# EAGLE design ATX80 (EAGLE 9.2.0)
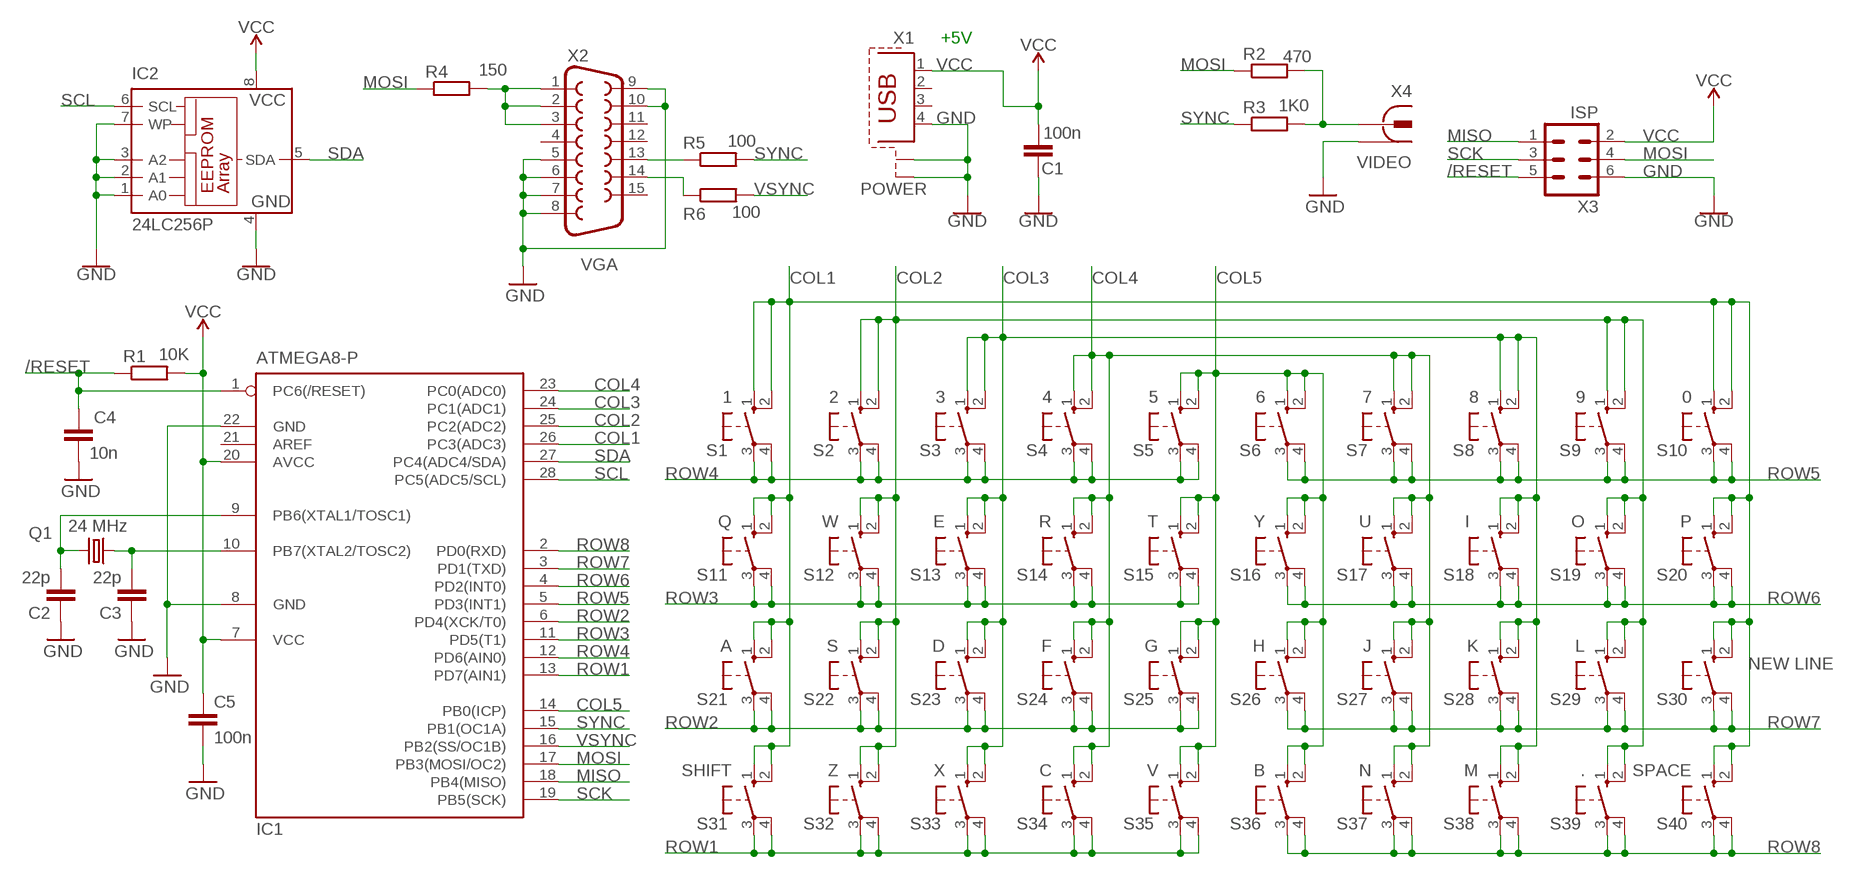
[diagram p0: schematic, sheet 1]

## Parts
C1  100n  C-EU050-024X044  [C050-024X044]
C2  22p  C-EU050-024X044  [C050-024X044]
C3  22p  C-EU050-024X044  [C050-024X044]
C4  10n  C-EU050-024X044  [C050-024X044]
C5  100n  C-EU050-024X044  [C050-024X044]
IC1  ATMEGA8-P  MEGA8-P  [DIL28-3]
IC2  24LC256P  [DIL8]
Q1  24 MHz  CRYSTALHC49U-V  [HC49U-V]
R1  10K  R-EU_0204/7  [0204/7]
R2  470  R-EU_0204/7  [0204/7]
R3  1K0  R-EU_0204/7  [0204/7]
R4  150  R-EU_0204/7  [0204/7]
R5  100  R-EU_0204/7  [0204/7]
R6  100  R-EU_0204/7  [0204/7]
S1  1  10-XX  [B3F-10XX]
S2  2  10-XX  [B3F-10XX]
S3  3  10-XX  [B3F-10XX]
S4  4  10-XX  [B3F-10XX]
S5  5  10-XX  [B3F-10XX]
S6  6  10-XX  [B3F-10XX]
S7  7  10-XX  [B3F-10XX]
S8  8  10-XX  [B3F-10XX]
S9  9  10-XX  [B3F-10XX]
S10  0  10-XX  [B3F-10XX]
S11  Q  10-XX  [B3F-10XX]
S12  W  10-XX  [B3F-10XX]
S13  E  10-XX  [B3F-10XX]
S14  R  10-XX  [B3F-10XX]
S15  T  10-XX  [B3F-10XX]
S16  Y  10-XX  [B3F-10XX]
S17  U  10-XX  [B3F-10XX]
S18  I  10-XX  [B3F-10XX]
S19  O  10-XX  [B3F-10XX]
S20  P  10-XX  [B3F-10XX]
S21  A  10-XX  [B3F-10XX]
S22  S  10-XX  [B3F-10XX]
S23  D  10-XX  [B3F-10XX]
S24  F  10-XX  [B3F-10XX]
S25  G  10-XX  [B3F-10XX]
S26  H  10-XX  [B3F-10XX]
S27  J  10-XX  [B3F-10XX]
S28  K  10-XX  [B3F-10XX]
S29  L  10-XX  [B3F-10XX]
S30  NEW LINE  10-XX  [B3F-10XX]
S31  SHIFT  10-XX  [B3F-10XX]
S32  Z  10-XX  [B3F-10XX]
S33  X  10-XX  [B3F-10XX]
S34  C  10-XX  [B3F-10XX]
S35  V  10-XX  [B3F-10XX]
S36  B  10-XX  [B3F-10XX]
S37  N  10-XX  [B3F-10XX]
S38  M  10-XX  [B3F-10XX]
S39  .  10-XX  [B3F-10XX]
S40  SPACE  10-XX  [B3F-10XX]
X1  POWER  PN61729-S  [PN61729-S]
X2  VGA  F15HDH  [HDF15H]
X3  ISP  ML6L  [ML6L]
X4  VIDEO  736880-49  [736880-49]

## Nets
/RESET: C4.1 IC1.1(PC6(/RESET)) R1.1 X3.5
COL1: IC1.26(PC3(ADC3)) S1.1(S) S1.2(S1) S10.1(S) S10.2(S1) S11.1(S) S11.2(S1) S20.1(S) S20.2(S1) S21.1(S) S21.2(S1) S30.1(S) S30.2(S1) S31.1(S) S31.2(S1) S40.1(S) S40.2(S1)
COL2: IC1.25(PC2(ADC2)) S2.1(S) S2.2(S1) S9.1(S) S9.2(S1) S12.1(S) S12.2(S1) S19.1(S) S19.2(S1) S22.1(S) S22.2(S1) S29.1(S) S29.2(S1) S32.1(S) S32.2(S1) S39.1(S) S39.2(S1)
COL3: IC1.24(PC1(ADC1)) S3.1(S) S3.2(S1) S8.1(S) S8.2(S1) S13.1(S) S13.2(S1) S18.1(S) S18.2(S1) S23.1(S) S23.2(S1) S28.1(S) S28.2(S1) S33.1(S) S33.2(S1) S38.1(S) S38.2(S1)
COL4: IC1.23(PC0(ADC0)) S4.1(S) S4.2(S1) S7.1(S) S7.2(S1) S14.1(S) S14.2(S1) S17.1(S) S17.2(S1) S24.1(S) S24.2(S1) S27.1(S) S27.2(S1) S34.1(S) S34.2(S1) S37.1(S) S37.2(S1)
COL5: IC1.14(PB0(ICP)) S5.1(S) S5.2(S1) S6.1(S) S6.2(S1) S15.1(S) S15.2(S1) S16.1(S) S16.2(S1) S25.1(S) S25.2(S1) S26.1(S) S26.2(S1) S35.1(S) S35.2(S1) S36.1(S) S36.2(S1)
GND: C1.1 C2.1 C3.1 C4.2 C5.2 IC1.8(GND) IC1.22(GND) IC2.1(A0) IC2.2(A1) IC2.3(A2) IC2.4(GND) IC2.7(WP) X1.4 X1.S1 X1.S2 X2.5 X2.6 X2.7 X2.8 X2.9 X2.10 X3.6 X4.1 X4.1@1 X4.1@2
MISO: IC1.18(PB4(MISO)) X3.1
MOSI: IC1.17(PB3(MOSI/OC2)) R2.1 R4.1 X3.4
N$2: R6.1 X2.14
N$13: R5.1 X2.13
N$14: R4.2 X2.1 X2.2 X2.3
N$15: C2.2 IC1.9(PB6(XTAL1/TOSC1)) Q1.2
N$16: C3.2 IC1.10(PB7(XTAL2/TOSC2)) Q1.1
N$18: R2.2 R3.2 X4.2
ROW1: IC1.13(PD7(AIN1)) S31.3(P) S31.4(P1) S32.3(P) S32.4(P1) S33.3(P) S33.4(P1) S34.3(P) S34.4(P1) S35.3(P) S35.4(P1)
ROW2: IC1.6(PD4(XCK/T0)) S21.3(P) S21.4(P1) S22.3(P) S22.4(P1) S23.3(P) S23.4(P1) S24.3(P) S24.4(P1) S25.3(P) S25.4(P1)
ROW3: IC1.11(PD5(T1)) S11.3(P) S11.4(P1) S12.3(P) S12.4(P1) S13.3(P) S13.4(P1) S14.3(P) S14.4(P1) S15.3(P) S15.4(P1)
ROW4: IC1.12(PD6(AIN0)) S1.3(P) S1.4(P1) S2.3(P) S2.4(P1) S3.3(P) S3.4(P1) S4.3(P) S4.4(P1) S5.3(P) S5.4(P1)
ROW5: IC1.5(PD3(INT1)) S6.3(P) S6.4(P1) S7.3(P) S7.4(P1) S8.3(P) S8.4(P1) S9.3(P) S9.4(P1) S10.3(P) S10.4(P1)
ROW6: IC1.4(PD2(INT0)) S16.3(P) S16.4(P1) S17.3(P) S17.4(P1) S18.3(P) S18.4(P1) S19.3(P) S19.4(P1) S20.3(P) S20.4(P1)
ROW7: IC1.3(PD1(TXD)) S26.3(P) S26.4(P1) S27.3(P) S27.4(P1) S28.3(P) S28.4(P1) S29.3(P) S29.4(P1) S30.3(P) S30.4(P1)
ROW8: IC1.2(PD0(RXD)) S36.3(P) S36.4(P1) S37.3(P) S37.4(P1) S38.3(P) S38.4(P1) S39.3(P) S39.4(P1) S40.3(P) S40.4(P1)
SCK: IC1.19(PB5(SCK)) X3.3
SCL: IC1.28(PC5(ADC5/SCL)) IC2.6(SCL)
SDA: IC1.27(PC4(ADC4/SDA)) IC2.5(SDA)
SYNC: IC1.15(PB1(OC1A)) R3.1 R5.2
VCC: C1.2 C5.1 IC1.7(VCC) IC1.20(AVCC) IC2.8(VCC) R1.2 X1.1 X3.2
VSYNC: IC1.16(PB2(SS/OC1B)) R6.2
Unconnected: IC1.21(AREF) X1.2 X1.3 X2.4 X2.11 X2.12 X2.15

## Notes on the sheet
- +5V

## Library data of the parts
C1-C5 = rcl:C-EU: CAPACITOR, European symbol; SPICEPREFIX: C
IC1 = atmel:MEGA8-P: MICROCONTROLLER 8 Kbytes FLASH, 1 kbytes SRAM, 512 bytes EEPROM, USART, 4-channel 10 bit ADC, 2-channel 8 bit ADC Pin compatible with Atmega48, ATMega88, ATMega168 Source: avr.lbr; OC_FARNELL: unknown; OC_NEWARK: unknown
IC2 = microchip:24*: Serial EEPROM I2C; MF: MICROCHIP; MPN: 24LC256-E/P; OC_FARNELL: 9757970; OC_NEWARK: 92C7169
Q1 = crystal:CRYSTAL: CRYSTAL; OC_FARNELL: 1666969; OC_NEWARK: unknown
R1-R6 = rcl:R-EU_: RESISTOR, European symbol; SPICEPREFIX: R
S1-S40 = switch-omron2:10-XX: OMRON SWITCH; MPN: B3F-1000; OC_FARNELL: 176432; OC_NEWARK: 36M3542
X1 = con-berg:PN61729-S: BERG USB connector; OC_FARNELL: unknown; OC_NEWARK: unknown
X2 = adafruit_B:F15: SUB-D HDH is also known as a 'right angle VGA' connector
X3 = con-ml:ML6L: HARTING; OC_FARNELL: unknown; OC_NEWARK: unknown
X4 = con-conrad:736880-49: Cinch Connector ( RCA Jack ) Cinch-Einbaukupplung 90º 72345 Vernickelt BKL Electronic Source: Conrad <http://www.conrad.de/ce/de/product/736880>

## Net classes
0 default: width 0.6 mm, drill 0.3 mm

## Board
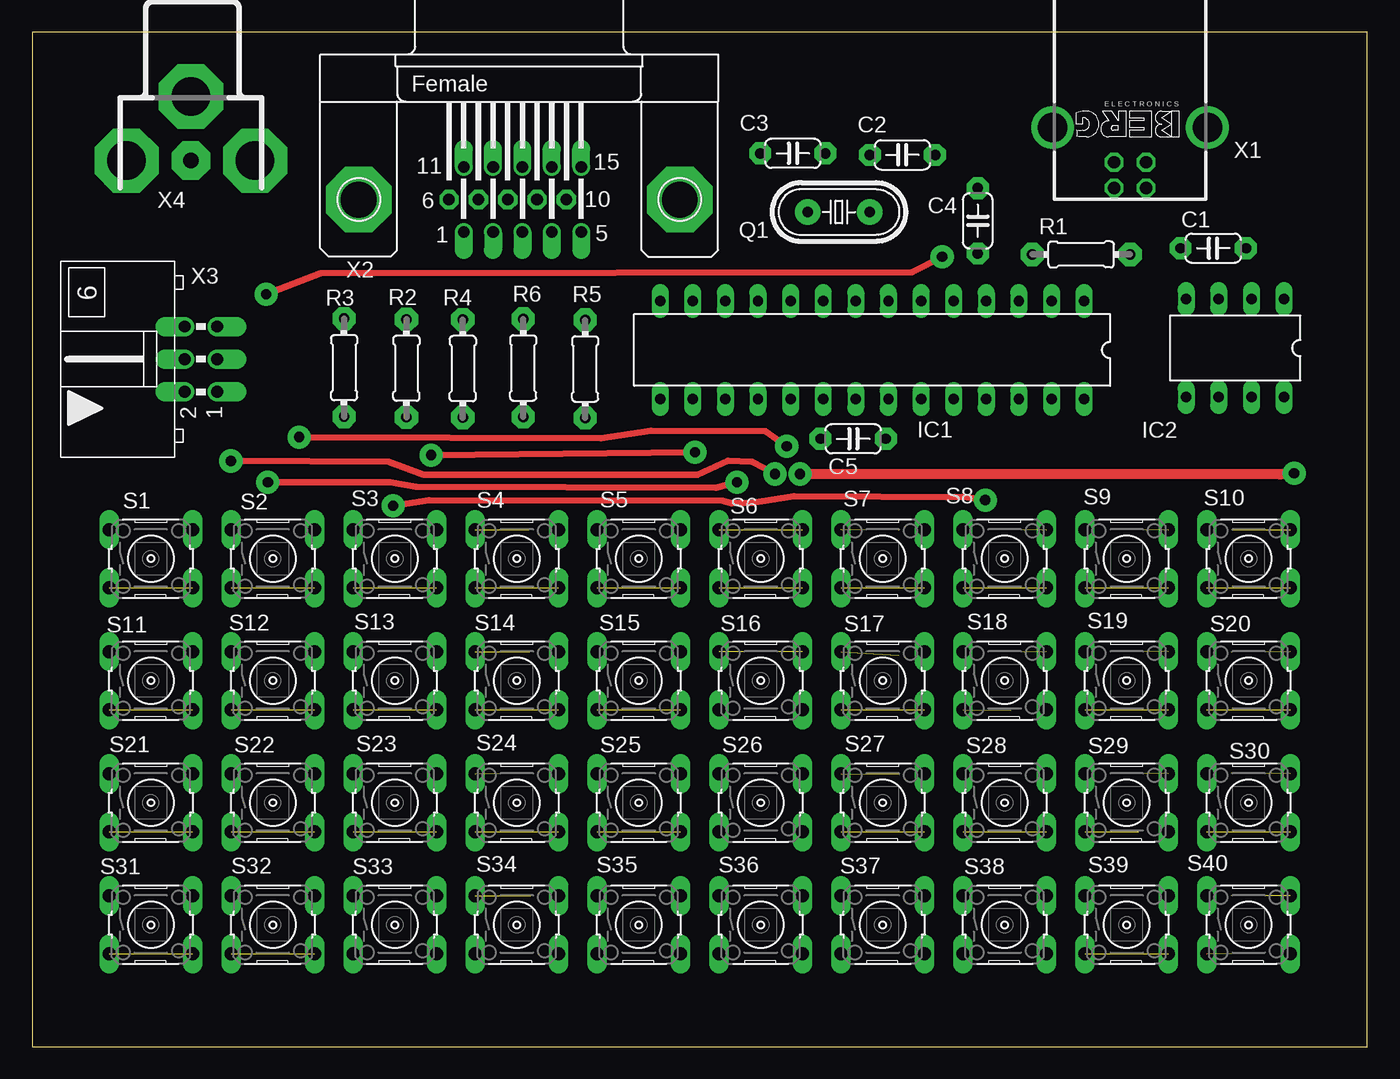
[diagram p1: board, top side]
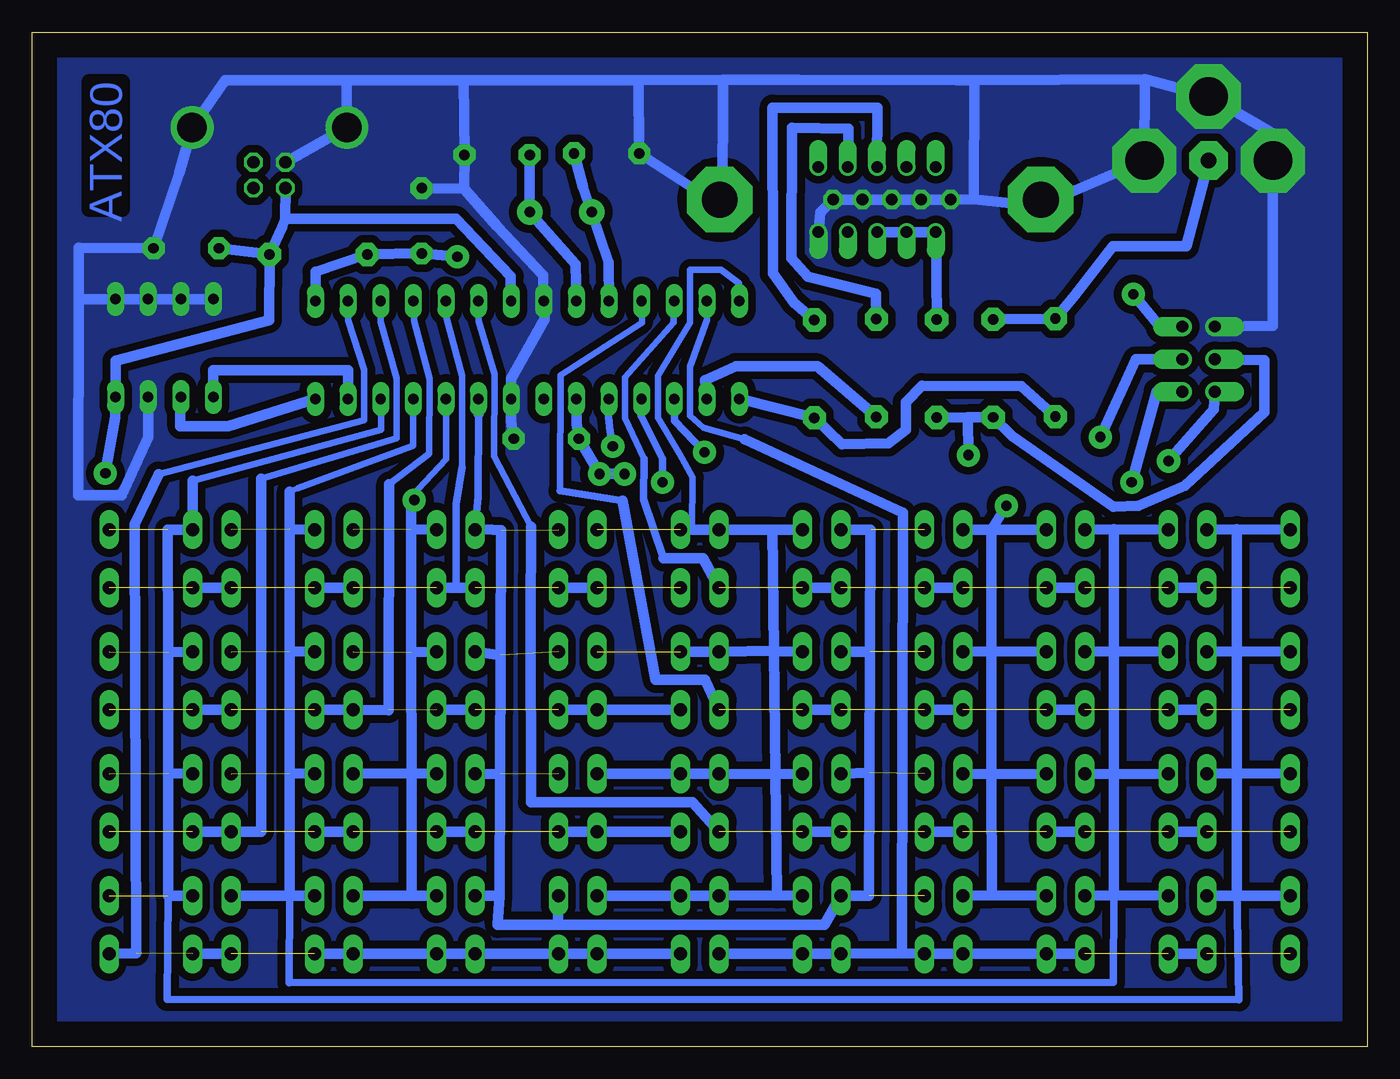
[diagram p2: board, bottom side, seen from below]

Size 104 x 79 mm. Coordinates in mm from the lower left corner, seen from the top.
Outline: 0,0 104,0 104,79 0,79 0,0
Copper layers (1*16): Top 0.035mm / dielectric 1.5mm / Bottom 0.035mm
Design rules "default": minimum track width 6mil, minimum drill 0.35mm, track to track 6mil, track to pad 6mil, pad to pad 6mil, via to via 6mil, smd to smd 6mil, copper to edge 40mil, drill to drill 6mil, minimum pad ring 10mil, minimum via ring 8mil, stop-mask expansion 4mil, vias tented up to drill 0mil, thermal gap 10mil

### Footprints (pad centres in the part's own frame; a part is rotated, then mirrored left to right if it is on the bottom)
C050-024X044 = drill 0.813 pad 1.7 octagon: 1 -2.54,0; 2 2.54,0
DIL28-3 = drill 0.813 long: 1 -16.51,-3.81; 2 -13.97,-3.81; 3 -11.43,-3.81; 4 -8.89,-3.81; 5 -6.35,-3.81; 6 -3.81,-3.81; 7 -1.27,-3.81; 8 1.27,-3.81; 9 3.81,-3.81; 10 6.35,-3.81; 11 8.89,-3.81; 12 11.43,-3.81; 13 13.97,-3.81; 14 16.51,-3.81; 15 16.51,3.81; 16 13.97,3.81; 17 11.43,3.81; 18 8.89,3.81; 19 6.35,3.81; 20 3.81,3.81; 21 1.27,3.81; 22 -1.27,3.81; 23 -3.81,3.81; 24 -6.35,3.81; 25 -8.89,3.81; 26 -11.43,3.81; 27 -13.97,3.81; 28 -16.51,3.81
DIL8 = drill 0.813 long: 1 -3.81,-3.81; 2 -1.27,-3.81; 3 1.27,-3.81; 4 3.81,-3.81; 5 3.81,3.81; 6 1.27,3.81; 7 -1.27,3.81; 8 -3.81,3.81
HC49U-V = drill 0.813 pad 2: 1 -2.413,0; 2 2.413,0
0204/7 = drill 0.813 pad 1.8 octagon: 1 -3.81,0; 2 3.81,0
B3F-10XX = drill 1.016 long: 1 -3.251,2.261; 2 3.251,2.261; 3 -3.251,-2.261; 4 3.251,-2.261
PN61729-S = drill 0.95 octagon: 1 1.25,4.71; 2 -1.25,4.71; 3 -1.25,2.71; 4 1.25,2.71 | drill 2.3 pad 2.9: S1 -6.02,0; S2 6.02,0
HDF15H = drill 0.9 pad 1.27 offset: 1 4.329,2.54; 2 2.043,2.54; 3 -0.243,2.54; 4 -2.529,2.54; 5 -4.815,2.54; 11 4.329,-2.54; 12 2.043,-2.54; 13 -0.243,-2.54; 14 -2.529,-2.54; 15 -4.815,-2.54 | drill 0.9 pad 1.5 octagon: 6 5.472,0; 7 3.186,0; 8 0.9,0; 9 -1.386,0; 10 -3.672,0 | drill 2.8 pad 5.08 octagon: P$1 -12.5,0; P$2 12.5,0
ML6L = drill 0.914 pad 1.5 offset: 1 -2.54,-1.27; 2 -2.54,1.27; 3 0,-1.27; 4 0,1.27; 5 2.54,-1.27; 6 2.54,1.27
736880-49 = drill 3 pad 5 octagon: 1 -2.5,0; 1@1 2.5,-5; 1@2 2.5,5 | drill 1.2 pad 3 octagon: 2 2.5,0

### Placement (x,y rotation side)
C1  91.99,62.17 180 top
C2  67.79,69.44 180 top
C3  59.25,69.56 0 top
C4  73.65,64.31 90 top
C5  63.95,47.34 0 top
IC1  65.42,54.25 180 top
IC2  93.69,54.4 180 top
Q1  62.83,64.99 0 top
R1  81.71,61.69 0 top
R2  29.15,52.83 90 top
R3  24.3,52.88 90 top
R4  33.55,52.8 90 top
R5  43.07,52.77 270 top
R6  38.25,52.85 270 top
S1  9.25,38 0 top
S2  18.75,38 0 top
S3  28.25,38 0 top
S4  37.75,38 0 top
S5  47.25,38 0 top
S6  56.75,38 0 top
S7  66.25,38 0 top
S8  75.75,38 0 top
S9  85.25,38 0 top
S10  94.75,38 0 top
S11  9.25,28.5 0 top
S12  18.75,28.5 0 top
S13  28.25,28.5 0 top
S14  37.75,28.5 0 top
S15  47.25,28.5 0 top
S16  56.75,28.5 0 top
S17  66.25,28.5 0 top
S18  75.75,28.5 0 top
S19  85.25,28.5 0 top
S20  94.75,28.5 0 top
S21  9.25,19 0 top
S22  18.75,19 0 top
S23  28.25,19 0 top
S24  37.75,19 0 top
S25  47.25,19 0 top
S26  56.75,19 0 top
S27  66.25,19 0 top
S28  75.75,19 0 top
S29  85.25,19 0 top
S30  94.75,19 0 top
S31  9.25,9.5 0 top
S32  18.75,9.5 0 top
S33  28.25,9.5 0 top
S34  37.75,9.5 0 top
S35  47.25,9.5 0 top
S36  56.75,9.5 0 top
S37  66.25,9.5 0 top
S38  75.75,9.5 0 top
S39  85.25,9.5 0 top
S40  94.75,9.5 0 top
X1  85.52,71.57 180 top
X2  37.94,65.96 180 top
X3  13.15,53.54 90 top
X4  12.36,71.49 270 top

### Tracks (layer width: path | path; a pad name or v marks a point on that pad's centre or on a via)
/RESET  (via drill 0.8 pad 1.8)
  Top 0.508: v70.89,61.51 68.52,60.29 22.47,60.24 v18.23,58.59
  Bottom 0.813: IC1.1 81.93,60.34 R1.1 C4.1 v70.89,61.51 | v18.23,58.59 16.17,56.05 X3.5
COL1  (4 unrouted)
  Bottom 0.508: 91.51,44.06 76.83,48.05 IC1.26
  Bottom 0.6: 93.39,11.75 93.47,3.7 10.03,3.65 10.15,12.41
  Bottom 0.813: S31.2 10.15,11.75 | 10.15,11.75 10.15,12.41 10.15,21.3 | 10.15,21.3 10.15,30.8 | 10.15,30.8 10.15,40.3 | S1.2 10.15,40.3 | S11.2 10.15,30.8 | S21.2 10.15,21.3 | S40.1 93.39,11.75 93.41,21.3 | 93.41,21.3 93.42,30.73 | 93.42,30.73 93.44,40.25 S10.1 91.51,44.06 | S20.1 93.42,30.73 | S30.1 93.41,21.3 | 10.15,40.3 S1.1 | S11.1 10.15,30.8 | S21.1 10.15,21.3 | S31.1 10.15,11.75
COL2  (3 unrouted)
  Bottom 0.508: 83.94,43.22 83.33,43.5 74.31,46.78 IC1.25
  Bottom 0.6: 19.75,11.8 19.78,5.02 83.99,5 83.94,11.75
  Bottom 0.813: S32.2 19.75,11.8 | 19.75,11.8 19.75,21.2 | 19.75,21.2 19.75,30.8 | 19.75,30.8 19.75,40.3 | S2.2 19.75,40.3 | S12.2 19.75,30.8 | S22.2 19.75,21.2 | S39.1 83.94,11.75 | 83.94,11.75 83.94,21.3 | 83.94,21.3 83.94,30.8 | 83.94,30.8 83.94,40.3 | 83.94,40.3 83.94,43.22 | S9.1 83.94,40.3 | S19.1 83.94,30.8 | S29.1 83.94,21.3 | S32.1 19.75,11.8 | S22.1 19.75,21.2 | S12.1 19.75,30.8 | S2.1 19.75,40.3 | S39.2 83.94,11.75
COL3  (via drill 0.8 pad 1.8)  (2 unrouted)
  Top 0.508: v28.11,42.13 30.93,42.54 53.79,42.51 54.48,42.34 56.1,42.36 59.33,42.87 72.84,42.79 v74.24,42.56
  Bottom 0.508: 74.49,42.82 71.77,45.74 IC1.24
  Bottom 0.813: S33.2 29.25,11.8 | 29.25,11.8 29.27,21.2 | 29.27,21.2 29.29,30.8 | 29.29,30.8 29.3,40.25 | 29.3,40.25 v28.11,42.13 | S3.2 29.3,40.25 | S13.2 29.29,30.8 | S23.2 29.27,21.2 | S38.1 74.44,11.75 | 74.44,11.75 74.46,21.3 | 74.46,21.3 74.47,30.7 | 74.47,30.7 74.49,40.3 | 74.49,40.3 74.49,42.82 v74.24,42.56 | S8.1 74.49,40.3 | S18.1 74.47,30.7 | S28.1 74.46,21.3 | S3.1 29.3,40.25 | S13.1 29.29,30.8 | S23.1 29.27,21.2 | S33.1 29.25,11.8 | 74.44,11.75 S38.2 | S28.2 74.46,21.3
COL4  (7 unrouted)
  Bottom 0.6: 69.49,40.34 69.26,42.82 69.23,49.27
  Bottom 0.813: 38.78,21.36 38.83,11.75 S34.2 42.28,9.49 63.04,9.49 | 38.78,21.36 38.74,30.75 | 38.74,30.75 38.69,40.25 S4.2 | S14.2 38.74,30.75 | S24.2 38.78,21.36 | S7.2 69.49,40.34 67.46,40.2 67.51,30.5 | 69.23,49.27 IC1.23 | S37.2 67.61,11.75 | 67.61,11.75 67.56,21.2 | 67.56,21.2 67.51,30.5 | 67.51,30.5 S17.2 | S27.2 67.56,21.2 | 63.04,9.49 67.73,9.49 67.61,11.75 | S37.1 63.04,9.49
COL5  (2 unrouted)
  Bottom 0.508: 52.62,40.25 52.55,44.34 53.56,46.17 55.26,48.97 55.24,52.24 52.75,56.36 52.75,60.5 50.36,60.5 48.94,59.45 IC1.14
  Bottom 0.813: S16.1 S15.2 46.2,30.83 | S5.2 S6.1 | S35.1 45.97,11.78 | 45.97,11.78 46.09,21.2 | 46.09,21.2 46.2,30.83 | 46.2,30.83 46.32,40.25 | 46.32,40.25 S5.1 | S15.1 46.2,30.78 46.2,30.83 | S25.1 46.09,21.2 | S5.2 52.62,40.25 | 45.97,11.78 S35.2 S36.1 S36.2 | S26.2 S26.1 S25.2 46.09,21.2 | 46.32,40.25 S5.2
GND
  Bottom 0.813: IC2.4 IC2.3 IC2.2 IC2.1 100.37,58.21 | X3.6 7.36,56.13 X4.1@1 7.26,71.06 X4.1 17.34,75.33 | 17.34,75.33 X4.1@2 25.67,65.42 30.65,65.98 | 17.34,75.33 30.6,75.25 | 30.6,75.25 30.65,65.98 | 30.65,65.98 X2.6 X2.7 X2.8 X2.9 X2.10 42.59,64.99 X2.5 | 30.6,75.25 32,75.25 44.32,75.3 50.18,75.29 | 50.18,75.29 56.76,75.27 | 56.76,75.27 70.4,75.27 | 70.4,75.27 79.49,75.27 | 79.49,75.27 88.97,75.25 X1.S1 92.53,68.02 C1.1 100.37,62.2 100.37,58.21 | 79.49,75.27 X1.S2 X1.4 | 56.76,75.27 C3.1 50.23,65.37 50.18,75.29 | 70.4,75.27 C2.1 70.36,66.81 | 70.36,66.81 67.79,63.87 64.2,60.06 IC1.8 64.1,56.63 66.69,52.01 IC1.22 66.69,48.71 C5.2 | C4.2 70.36,66.81 | IC2.7 94.96,47.44 97.02,42.95 100.4,42.95 100.37,58.21
  pour Bottom (isolate 0.61, no thermals): 2,77 2,2 102,2 102,77
MISO  (via drill 0.8 pad 1.8)
  Top 0.508: v18.36,43.96 19.78,43.96 27.88,43.94 29.89,43.6 53.26,43.53 v54.91,43.96
  Bottom 0.6: v54.91,43.96 54.88,45.76 56.56,49.12 IC1.18
  Bottom 0.813: X3.1 16.4,51.05 v18.36,43.96
MOSI  (via drill 0.8 pad 1.8)
  Top 0.508: v51.63,46.3 v31.08,46.07
  Bottom 0.6: IC1.17 53.97,48.74 v51.63,46.3
  Bottom 0.813: X3.4 8.04,53.46 8.04,49.42 14.22,43.68 17.85,42.11 19.8,42.06 27.65,47.52 R2.1 31.13,49 | 31.13,49 R4.1 | v31.08,46.07 31.13,49
N$2
  Bottom 0.813: X2.14 40.43,71.49 44.82,71.55 44.85,61.41 43.55,59.94 38.27,58.62 R6.1
N$13
  Bottom 0.813: R5.1 44.67,57.93 46.3,60.22 46.32,73.12 38.14,73.09 X2.13
N$14
  Bottom 0.813: R4.2 X2.1 X2.2 X2.3
N$15
  Bottom 0.813: C2.2 Q1.2 61.66,60.93 IC1.9
N$16
  Bottom 0.813: IC1.10 59.1,61.08 Q1.1 61.08,66.92 C3.2
N$18
  Bottom 0.813: R2.2 R3.2 22.78,58.52 19.83,62.33 14.12,62.33 X4.2
ROW1  (2 unrouted)
  Bottom 0.508: IC1.13 51.45,56.61 52.77,52.93 52.77,49.12 51.71,48.18 48.51,47.29
  Bottom 0.813: S32.4 S33.3 S33.4 S34.3 36.27,7.28 | S32.3 S31.4 | 36.27,7.28 36.19,41.57 48.51,47.29 | S35.4 S35.3 S34.4 36.27,7.28
ROW2  (5 unrouted)
  Bottom 0.508: IC1.6 69.21,56.51 67.96,52.37 68.02,45.99 65.14,40.51
  Bottom 0.813: S21.4 S22.3 | S22.4 S23.3 | S23.4 S24.3 | S24.4 S25.3 | 65.14,40.51 65.17,33.27 65.14,19.04 52.55,19.04 S25.4
ROW3  (5 unrouted)
  Bottom 0.508: IC1.11 56.51,56.38 62.86,52.27 62.88,43.27
  Bottom 0.6: 62.88,43.27 58.01,42.51
  Bottom 0.813: S15.3 S14.4 | S14.3 S13.4 | S13.3 S12.4 | S12.3 S11.4 | 58.01,42.51 55.44,28.57 51.61,28.57 S15.4
ROW4  (5 unrouted)
  Bottom 0.508: IC1.12 54.05,56.38 57.8,52.11 57.8,48.94 56.36,45.79
  Bottom 0.6: 56.36,45.79 56.38,42.64 54.81,38.02
  Bottom 0.813: S1.4 S2.3 | S2.4 S3.3 | S3.4 S4.3 | S4.4 S5.3 | 54.81,38.02 51.73,38.02 S5.4
ROW5  (5 unrouted)
  Bottom 0.508: 70.5,45.13 70.5,52.24 71.72,56.74 IC1.5
  Bottom 0.6: 70.99,35.74 70.96,38.8 70.96,42.26 70.5,45.13
  Bottom 0.813: S6.4 S7.3 | S7.4 70.99,35.74 S8.3 | S8.4 S9.3 | S9.4 S10.3
ROW6  (4 unrouted)
  Bottom 0.508: 76.19,43.78 73.07,46.17 73.04,52.01 74.26,56.51 IC1.4
  Bottom 0.813: S20.3 S19.4 | S19.3 S18.4 76.22,26.21 76.19,43.78 | S18.3 S17.4 | S17.3 S16.4 S16.3
ROW7  (4 unrouted)
  Bottom 0.508: 86.15,44.22 75.61,47.39 75.61,52.04 76.85,56.46 IC1.3
  Bottom 0.813: S27.3 S26.4 S26.3 | S27.4 S28.3 | S28.4 S29.3 | S30.3 S29.4 86.18,16.76 86.15,44.22
ROW8  (2 unrouted)
  Bottom 0.508: IC1.2 79.37,56.56 78.12,52.7 78.12,48.79 94.15,44.57
  Bottom 0.813: S40.3 S39.4 | S39.3 S38.4 S38.3 S37.4 S37.3 S36.4 S36.3 | 94.15,44.57 96,40.68 95.9,7.28 S40.4
SCK  (via drill 0.8 pad 1.8)
  Top 0.508: v58.77,46.76 57.12,47.92 48.2,47.95 44.32,47.39 v20.8,47.47
  Bottom 0.6: IC1.19 59.1,49.02 59,47.93 v58.77,46.76
  Bottom 0.813: v20.8,47.47 18.05,53.51 X3.3
SCL
  Bottom 0.813: IC1.28 88.74,48.33 92.45,48.33 IC2.6
SDA
  Bottom 0.813: IC1.27 79.39,52.67 89.91,52.67 IC2.5
SYNC
  Bottom 0.813: IC1.15 R5.2 40.91,46.91 37.31,46.98 35.93,48.05 35.96,50.18 34.72,51.45 26.97,51.43 R3.1
VCC  (via drill 0.8 pad 1.8)
  Top 0.508: v15.49,45.61 27.76,45.56 30.47,44.52 51.81,44.52 54.2,45.61 56.05,45.54 v57.85,44.6
  Top 0.813: v59.81,44.6 97.2,44.57 v98.29,44.65
  Bottom 0.813: R1.2 84.53,63.82 84.31,64.48 | 84.31,64.48 X1.1 | R1.2 85.54,56.59 97.5,53.41 IC2.8 97.53,49.02 v98.29,44.65 | R1.2 C1.2 | IC1.7 66.72,59.99 70.96,64.46 71.95,64.48 84.31,64.48 | IC1.20 61.61,48.56 C5.1 v59.81,44.6 v57.85,44.6 | X3.2 11.96,49.62 v15.49,45.61
VSYNC
  Bottom 0.813: R6.2 42.84,52.98 49.19,53 51.58,51.89 IC1.16

### Text on the board
Bottom: ATX80